# EAGLE design introAu (EAGLE 6.4)
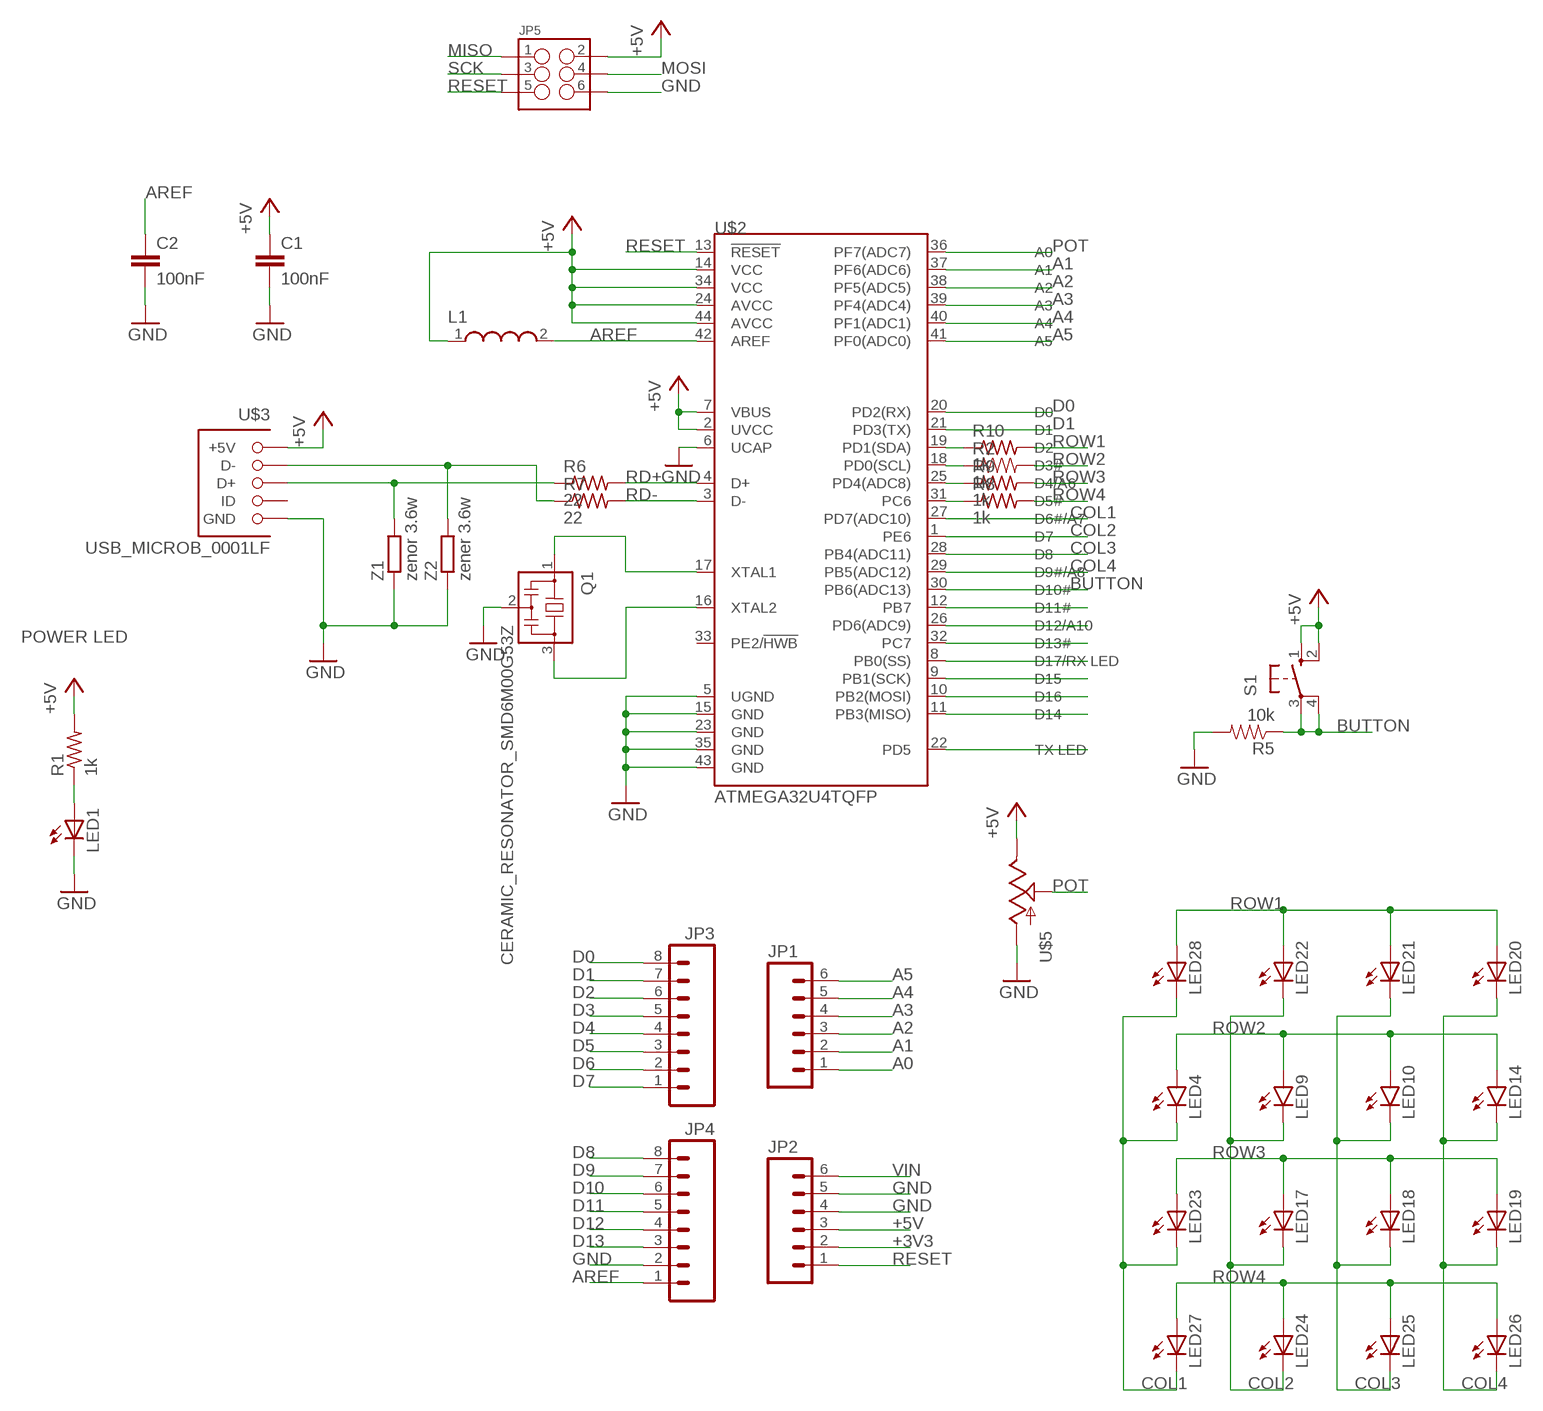
[diagram p0: schematic, sheet 1]

## Parts
C1  100nF  C-EUC0805  [C0805]
C2  100nF  C-EUC0805  [C0805]
JP1  M06SMD-STRAIGHT-COMBO  [1X06_SMD_STRAIGHT_COMBO]
JP2  M06SMD-STRAIGHT-COMBO  [1X06_SMD_STRAIGHT_COMBO]
JP3  M08SMD-COMBO  [1X08_SMD_COMBINED]
JP4  M08SMD-COMBO  [1X08_SMD_COMBINED]
JP5  M03X22X3_SILK_SM  [2X3]
L1  WE-CBF_0805(WB/HS)  [WE-CBF_0805(W=3.0)]
LED1  LEDCHIPLED_0805  [CHIPLED_0805]
LED4  LED5MM  [LED5MM]
LED9  LED5MM  [LED5MM]
LED10  LED5MM  [LED5MM]
LED14  LED5MM  [LED5MM]
LED17  LEDCHIPLED_0805  [CHIPLED_0805]
LED18  LEDCHIPLED_0805  [CHIPLED_0805]
LED19  LEDCHIPLED_0805  [CHIPLED_0805]
LED20  LEDCHIPLED_0805  [CHIPLED_0805]
LED21  LEDCHIPLED_0805  [CHIPLED_0805]
LED22  LEDCHIPLED_0805  [CHIPLED_0805]
LED23  LEDCHIPLED_0805  [CHIPLED_0805]
LED24  LEDCHIPLED_0805  [CHIPLED_0805]
LED25  LEDCHIPLED_0805  [CHIPLED_0805]
LED26  LEDCHIPLED_0805  [CHIPLED_0805]
LED27  LEDCHIPLED_0805  [CHIPLED_0805]
LED28  LEDCHIPLED_0805  [CHIPLED_0805]
Q1  CERAMIC_RESONATOR_SMD6M00G53Z  [CERAMIC_RESONATOR_SMD]
R1  1k  R-US_R0805  [R0805]
R2  1k  1KOHM1/4W5%(PTH)HORIZ-KIT  [AXIAL-0.3EZ]
R5  10k  1KOHM1/4W5%(PTH)HORIZ-KIT  [AXIAL-0.3EZ]
R6  22  R-US_R0805  [R0805]
R7  22  R-US_R0805  [R0805]
R8  1k  R-US_R0805  [R0805]
R9  1k  R-US_R0805  [R0805]
R10  1k  R-US_R0805  [R0805]
S1  TACT_BUTTON  [B3F-10XX]
U$2  ATMEGA32U4TQFP  [SPARKFUN-DIGITALIC_TQFP44]
U$3  USB_MICROB_0001LF  [USB_MICROB_CHEAPER]
U$5  POT  [ALPS_POT]
Z1  zenor 3.6w  R-EU_R0603  [R0603]
Z2  zener 3.6w  R-EU_R0603  [R0603]

## Nets
+3V3: JP2.2
+5V: C1.1 JP2.3 JP5.2 L1.1 R1.2 S1.1(S) S1.2(S1) U$2.2(UVCC) U$2.7(VBUS) U$2.14(VCC) U$2.24(AVCC) U$2.34(VCC) U$2.44(AVCC) U$3.P$1(+5V) U$5.P$1(E)
A0: JP1.1
A1: JP1.2 U$2.37(PF6(ADC6))
A2: JP1.3 U$2.38(PF5(ADC5))
A3: JP1.4 U$2.39(PF4(ADC4))
A4: JP1.5 U$2.40(PF1(ADC1))
A5: JP1.6 U$2.41(PF0(ADC0))
AREF: C2.1 JP4.1 L1.2 U$2.42(AREF)
BUTTON: R5.P$1 S1.3(P) S1.4(P1) U$2.30(PB6(ADC13))
COL1: LED4.K(C) LED23.C LED27.C LED28.C U$2.27(PD7(ADC10))
COL2: LED9.K(C) LED17.C LED22.C LED24.C U$2.1(PE6)
COL3: LED10.K(C) LED18.C LED21.C LED25.C U$2.28(PB4(ADC11))
COL4: LED14.K(C) LED19.C LED20.C LED26.C U$2.29(PB5(ADC12))
D0: JP3.8 U$2.20(PD2(RX))
D1: JP3.7 U$2.21(PD3(TX))
D2: JP3.6
D3: JP3.5
D4: JP3.4
D5: JP3.3
D6: JP3.2
D7: JP3.1
D8: JP4.8
D9: JP4.7
D10: JP4.6
D11: JP4.5 U$2.12(PB7)
D12: JP4.4 U$2.26(PD6(ADC9))
D13: JP4.3 U$2.32(PC7)
D14: U$2.11(PB3(MISO))
D15: U$2.9(PB1(SCK))
D16: U$2.10(PB2(MOSI))
D17: U$2.8(PB0(SS))
GND: C1.2 C2.2 JP2.4 JP2.5 JP4.2 JP5.6 LED1.C Q1.2 R5.P$2 U$2.5(UGND) U$2.6(UCAP) U$2.15(GND) U$2.23(GND) U$2.35(GND) U$2.43(GND) U$3.P$4(GND) U$5.P$3(A) Z1.1 Z2.1
MISO: JP5.1
MOSI: JP5.4
N$1: R10.1 U$2.19(PD1(SDA))
N$2: R2.P$1 U$2.18(PD0(SCL))
N$3: R9.1 U$2.25(PD4(ADC8))
N$4: R8.1 U$2.31(PC6)
N$5: Q1.3 U$2.16(XTAL2)
N$6: Q1.1 U$2.17(XTAL1)
N$7: R7.1 U$3.P$2(D-) Z2.2
N$9: R6.1 U$3.P$3(D+) Z1.2
N$11: LED1.A R1.1
POT: U$2.36(PF7(ADC7)) U$5.P$2(S)
RD+: R6.2 U$2.4(D+)
RD-: R7.2 U$2.3(D-)
RESET: JP2.1 JP5.5 U$2.13(!RESET)
ROW1: LED20.A LED21.A LED22.A LED28.A R10.2
ROW2: LED4.A LED9.A LED10.A LED14.A R2.P$2
ROW3: LED17.A LED18.A LED19.A LED23.A R9.2
ROW4: LED24.A LED25.A LED26.A LED27.A R8.2
SCK: JP5.3
TX: U$2.22(PD5)
VIN: JP2.6
Unconnected: U$2.33(PE2/!HWB) U$3.P$5(ID)

## Notes on the sheet
- POWER LED

## Library data of the parts
C1 C2 = rcl:C-EU: CAPACITOR, European symbol
JP1 JP2 = SparkFun-Connectors:M06: Header 6 Standard 6-pin 0.1" header. Use with straight break away headers (SKU : PRT-00116), right angle break away headers (PRT-00553), swiss pins (PRT-00743), machine pins (PRT-00117), and female headers (PRT-00115). Molex polarized connector foot print use with SKU : PRT-08094 with associated crimp pins and housings. NOTES ON THE VARIANTS LOCK and LOCK_LONGPADS... This footprint was designed to help hold the alignment of a through-hole component (i.e. 6-pin header) while soldering it into place. You may notice that each hole has been shifted either up or down by 0.005 of an inch from it's more standard position (which is a perfectly straight line). This slight alteration caused the pins (the squares in the middle) to touch the edges of the holes. Because they are alternating, it causes a "brace" to hold the component in place. 0.005 has proven to be the perfect amount of "off-center" position when using our standard breakaway headers. Although looks a little odd when you look at the bare footprint, once you have a header in there, the alteration is very hard to notice. Also,if you push a header all the way into place, it is covered up entirely on the bottom side. This idea of altering the position of holes to aid alignment will be further integrated into the Sparkfun Library for other footprints. It can help hold any component with 3 or more connection pins.
JP3 JP4 = SparkFun-Connectors:M08: Header 8 Standard 8-pin 0.1" header. Use with straight break away headers (SKU : PRT-00116), right angle break away headers (PRT-00553), swiss pins (PRT-00743), machine pins (PRT-00117), and female headers (PRT-00115).
JP5 = SparkFun-Connectors:M03X2: 2x3 .1" header. Shrouded, with keying- CONN-10681 SMT- CONN-11415 Pogo pins- HW-11044
L1 = EagleLibrary_Wuerth_Elektronik_eiSos_rev15c:WE-CBF: WE-CBF SMD EMI Suppression Ferrite Bead Characteristics Reliable Ni-Sn electrodes High rated current up to 6 A Operating temperature: –55 ºC to +125 ºC Applications Perfect as data lined filter and for uncoupling of distribution voltage Variant abbreviation WB means WIDE BAND HS means HIGH SPEED HC means HIGH CURRENT <http://katalog.we-online.de/media/images/eisos/FeCBF_pf2.jpg> Details see: http://katalog.we-online.de/en/pbs/WE-CBF Updated on 2014-06-19 2014 (C) Wurth Elektronik
LED1 LED17-LED28 = led:LED: LED OSRAM: - CHIPLED LG R971, LG N971, LY N971, LG Q971, LY Q971, LO R971, LY R971 LH N974, LH R974 LS Q976, LO Q976, LY Q976 LO Q996 - Hyper CHIPLED LW Q18S LB Q993, LB Q99A, LB R99A - SideLED LS A670, LO A670, LY A670, LG A670, LP A670 LB A673, LV A673, LT A673, LW A673 LH A674 LY A675 LS A676, LA A676, LO A676, LY A676, LW A676 LS A679, LY A679, LG A679 - Hyper Micro SIDELED® LS Y876, LA Y876, LO Y876, LY Y876 LT Y87S - SmartLED LW L88C, LW L88S LB L89C, LB L89S, LG L890 LS L89K, LO L89K, LY L89K LS L896, LA L896, LO L896, LY L896 - TOPLED LS T670, LO T670, LY T670, LG T670, LP T670 LSG T670, LSP T670, LSY T670, LOP T670, LYG T670 LG T671, LOG T671, LSG T671 LB T673, LV T673, LT T673, LW T673 LH T674 LS T676, LA T676, LO T676, LY T676, LB T676, LH T676, LSB T676, LW T676 LB T67C, LV T67C, LT T67C, LS T67K, LO T67K, LY T67K, LW E67C LS E67B, LA E67B, LO E67B, LY E67B, LB E67C, LV E67C, LT E67C LW T67C LS T679, LY T679, LG T679 LS T770, LO T770, LY T770, LG T770, LP T770 LB T773, LV T773, LT T773, LW T773 LH T774 LS E675, LA E675, LY E675, LS T675 LS T776, LA T776, LO T776, LY T776, LB T776 LHGB T686 LT T68C, LB T68C - Hyper Mini TOPLED® LB M676 - Mini TOPLED Santana® LG M470 LS M47K, LO M47K, LY M47K Source: http://www.osram.convergy.de LUXEON: - LUMILED® LXK2-PW12-R00, LXK2-PW12-S00, LXK2-PW14-U00, LXK2-PW14-V00 LXK2-PM12-R00, LXK2-PM12-S00, LXK2-PM14-U00 LXK2-PE12-Q00, LXK2-PE12-R00, LXK2-PE12-S00, LXK2-PE14-T00, LXK2-PE14-U00 LXK2-PB12-K00, LXK2-PB12-L00, LXK2-PB12-M00, LXK2-PB14-N00, LXK2-PB14-P00, LXK2-PB14-Q00 LXK2-PR12-L00, LXK2-PR12-M00, LXK2-PR14-Q00, LXK2-PR14-R00 LXK2-PD12-Q00, LXK2-PD12-R00, LXK2-PD12-S00 LXK2-PH12-R00, LXK2-PH12-S00 LXK2-PL12-P00, LXK2-PL12-Q00, LXK2-PL12-R00 Source: www.luxeon.com KINGBRIGHT: KA-3528ASYC Source: www.kingbright.com
LED4 LED9 LED10 LED14 = SparkFun-LED:LED: LEDs Standard schematic elements and footprints for 5mm, 3mm, 1206, and 0603 sized LEDs. 5mm - Spark Fun Electronics SKU : COM-00529 (and others)
Q1 = MESH_Arduino:CERAMIC_RESONATOR_SMD: Resonator Source: murata.co.jp; MPN: CSTCR6M00G53-R0; OC_FARNELL: 1170434; OC_NEWARK: 25M8759
R1 R6-R10 = rcl:R-US_: RESISTOR, American symbol
R2 = SparkFun-Resistors:1KOHM1/4W5%(PTH): RES-08380; PROD_ID: RES-08380
R5 = SparkFun-Resistors:1KOHM1/4W5%(PTH): RES-08380; PROD_ID: RES-08380; VALUE: 1k
S1 = MESH_Arduino:TACT_BUTTON: OMRON SWITCH; MPN: B3F-1000; OC_FARNELL: 176432; OC_NEWARK: 36M3542
U$2 = SparkFun-DigitalIC:ATMEGA32U4: Atmel 44-pin 8-bit Microcontroller with 32KBytes of ISP Flash and USB Controller ----- Please use the QFN-44-NOPAD_1:1 package for the footprint of all boards using a 32U4. Route traces directly away from the pads as much as possible.
U$3 = mBLE:USB_MICROB_0001LF
U$5 = SparkFun-Electromechanical:POT
Z1 Z2 = rcl:R-EU_: RESISTOR, European symbol

## Board
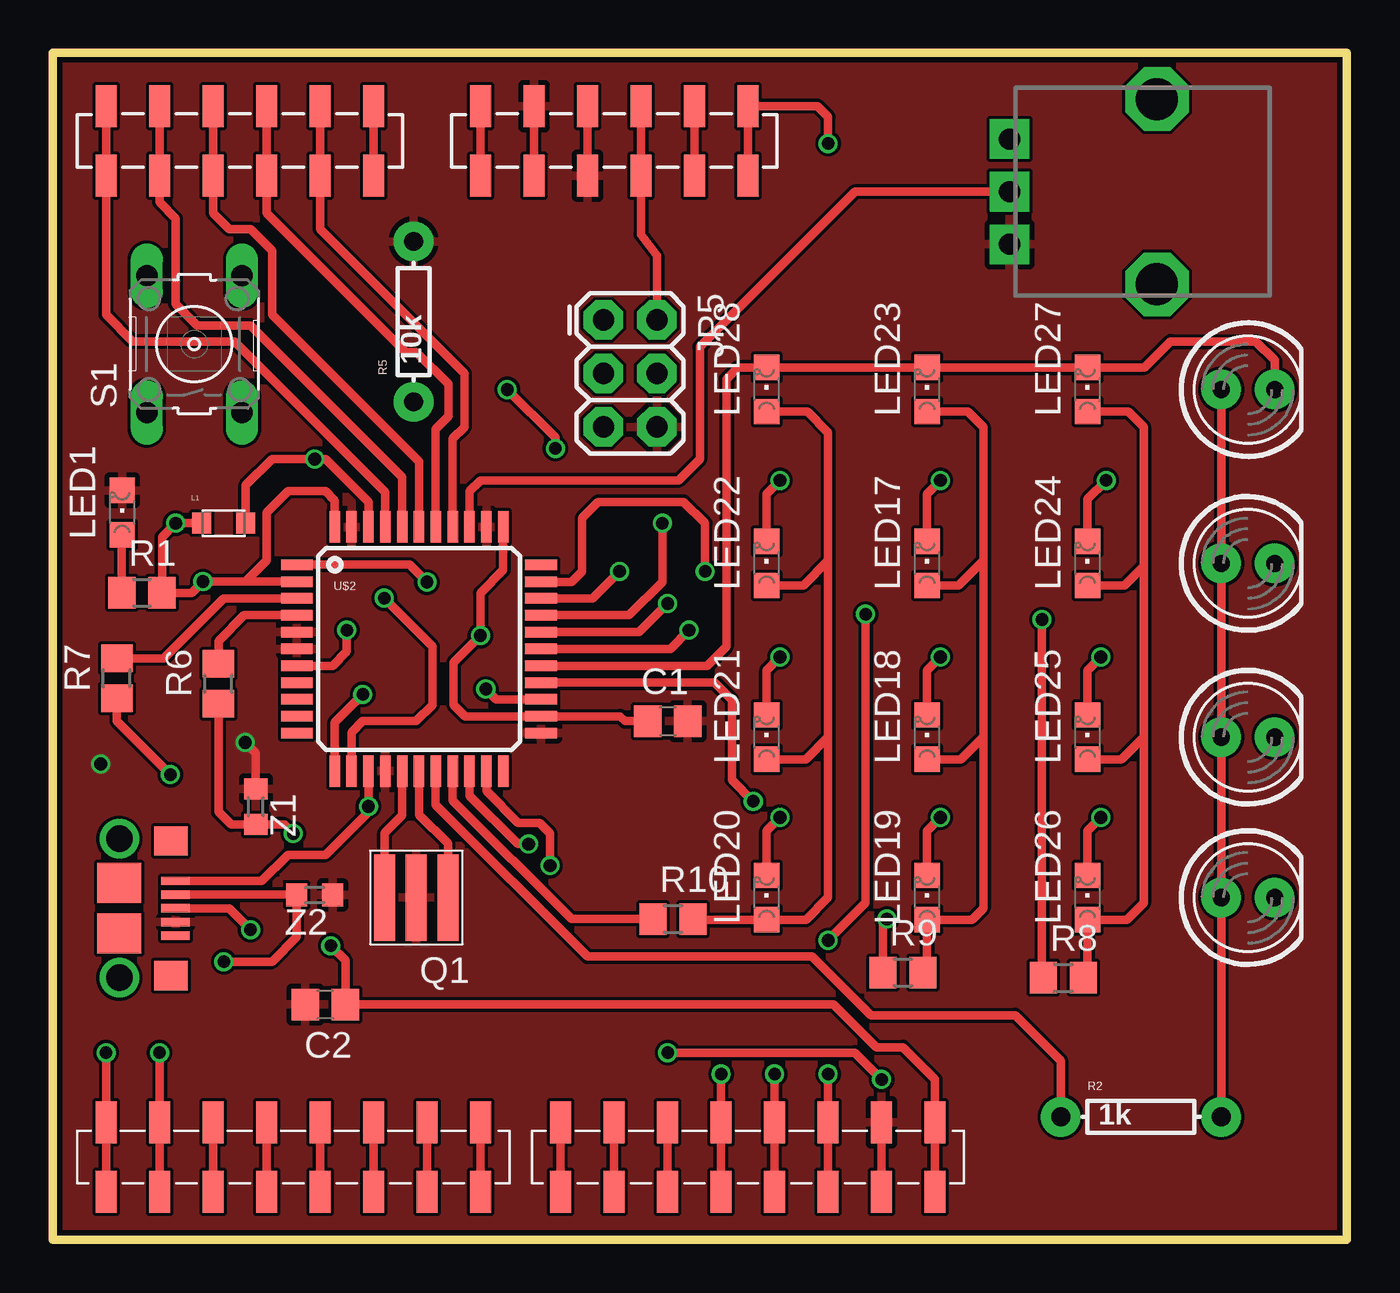
[diagram p1: board, top side]
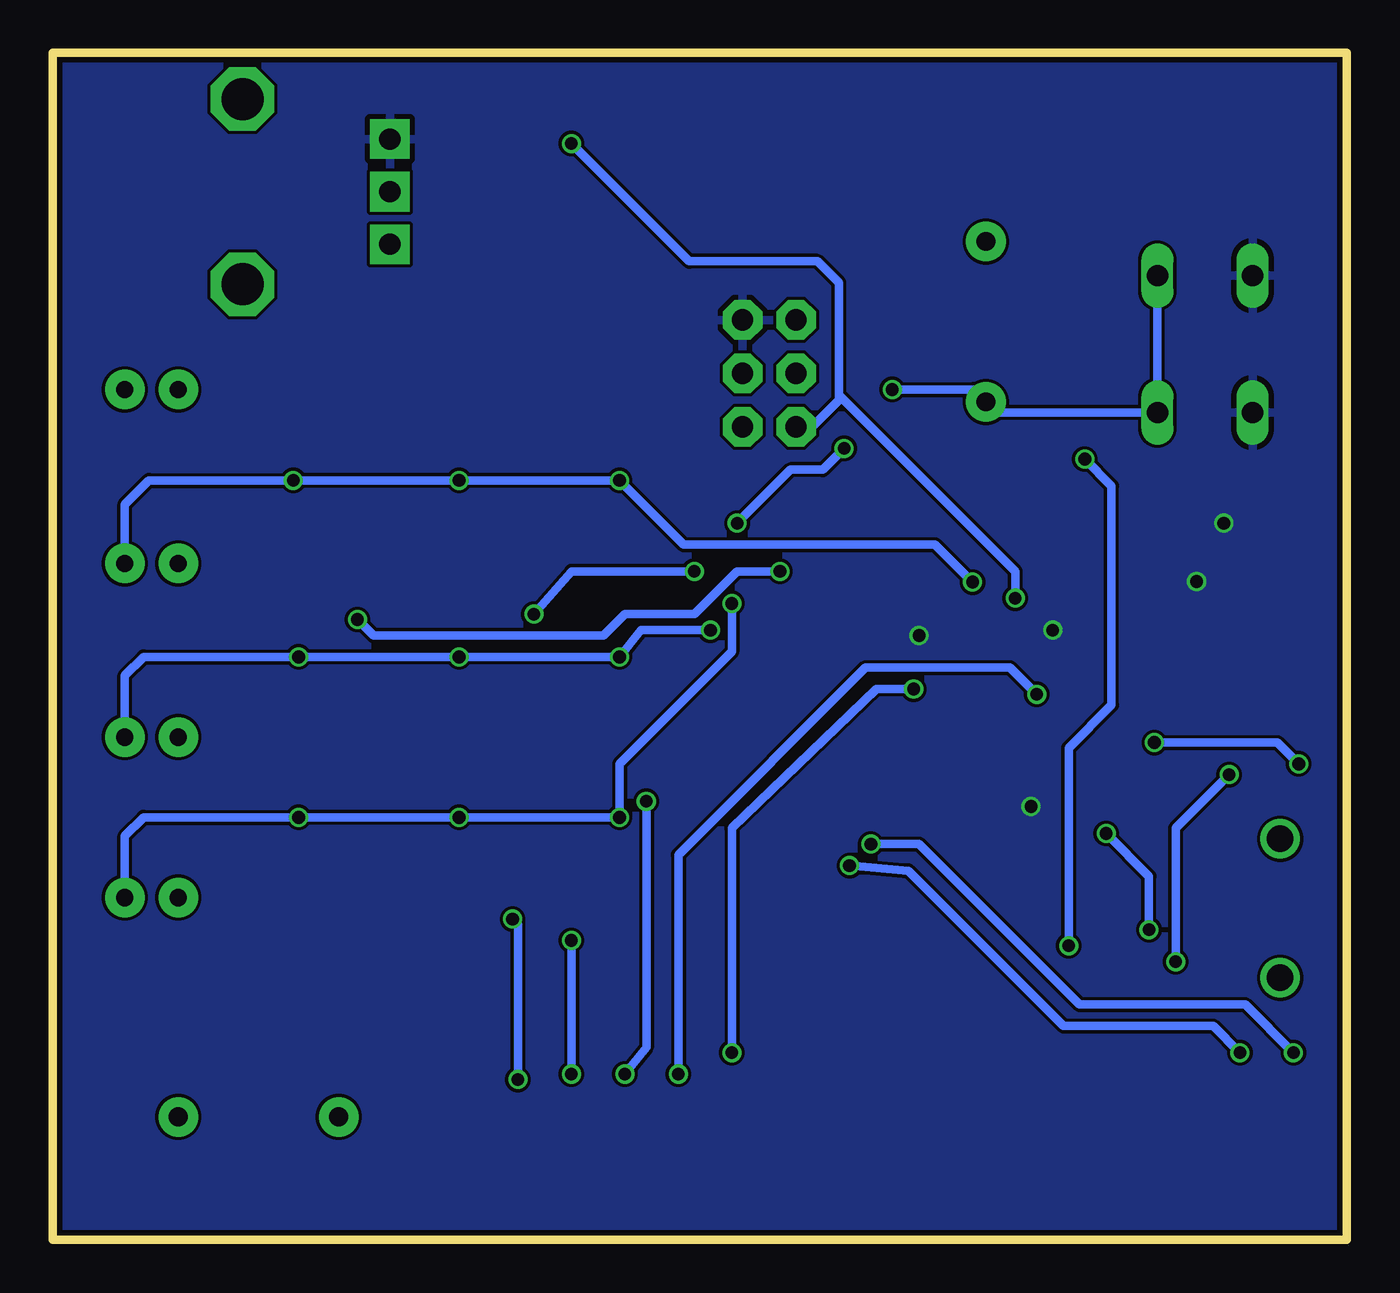
[diagram p2: board, bottom side, seen from below]

Size 61.47 x 56.39 mm. Coordinates in mm from the lower left corner, seen from the top.
Outline: 0,56.39 61.47,56.39 61.47,0 0,0 0,56.39
Copper layers (1*16): Top 0.035mm / dielectric 1.5mm / Bottom 0.035mm
Design rules "SeeedStudio_2layer_DRU_no_angle_20140221": minimum track width 6mil, minimum drill 12mil, track to track 6mil, track to pad 6mil, pad to pad 6mil, via to via 6mil, smd to smd 0mil, copper to edge 10mil, drill to drill 10mil, minimum pad ring 10mil, minimum via ring 6mil, stop-mask expansion 2mil, vias tented up to drill 100mil, thermal gap 10mil

### Footprints (pad centres in the part's own frame; a part is rotated, then mirrored left to right if it is on the bottom)
C0805 = smd 1.3 x 1.5: 1 -0.95,0; 2 0.95,0
1X06_SMD_STRAIGHT_COMBO = smd 1 x 2: 1 0,-1.65; 1-2 0,1.65; 2 2.54,1.65; 2-2 2.54,-1.65; 3 5.08,-1.65; 3-2 5.08,1.65; 4 7.62,1.65; 4-2 7.62,-1.65; 5 10.16,-1.65; 5-2 10.16,1.65; 6 12.7,1.65; 6-2 12.7,-1.65
1X08_SMD_COMBINED = smd 1 x 2: 1 0,1.65; 1@2 0,-1.65; 2 2.54,-1.65; 2@2 2.54,1.65; 3 5.08,1.65; 3@2 5.08,-1.65; 4 7.62,-1.65; 4@2 7.62,1.65; 5 10.16,1.65; 5@2 10.16,-1.65; 6 12.7,-1.65; 6@2 12.7,1.65; 7 15.24,1.65; 7@2 15.24,-1.65; 8 17.78,-1.65; 8@2 17.78,1.65
2X3 = drill 1.016 pad 1.88 octagon: 1 0,0; 2 0,2.54; 3 2.54,0; 4 2.54,2.54; 5 5.08,0; 6 5.08,2.54
WE-CBF_0805(W=3.0) = smd 0.9 x 1: 1 -1.05,0; 2 1.05,0
CHIPLED_0805 = smd 1.2 x 1.2: A 0,-1.05; C 0,1.05
LED5MM = drill 0.813 pad 1.88: A -1.27,0; K 1.27,0
CERAMIC_RESONATOR_SMD = smd 1 x 4.1: 1 -1.5,0; 2 0,0; 3 1.5,0
R0805 = smd 1.3 x 1.5: 1 -0.95,0; 2 0.95,0
AXIAL-0.3EZ = drill 0.9 pad 1.88: P$1 -3.81,0; P$2 3.81,0
B3F-10XX = drill 1.016 long: 1 -3.251,2.261; 2 3.251,2.261; 3 -3.251,-2.261; 4 3.251,-2.261
SPARKFUN-DIGITALIC_TQFP44 = smd 1.5 x 0.5: 1 -5.8,4; 2 -5.8,3.2; 3 -5.8,2.4; 4 -5.8,1.6; 5 -5.8,0.8; 6 -5.8,0; 7 -5.8,-0.8; 8 -5.8,-1.6; 9 -5.8,-2.4; 10 -5.8,-3.2; 11 -5.8,-4; 23 5.8,-4; 24 5.8,-3.2; 25 5.8,-2.4; 26 5.8,-1.6; 27 5.8,-0.8; 28 5.8,0; 29 5.8,0.8; 30 5.8,1.6; 31 5.8,2.4; 32 5.8,3.2; 33 5.8,4 | smd 0.5 x 1.5: 12 -4,-5.8; 13 -3.2,-5.8; 14 -2.4,-5.8; 15 -1.6,-5.8; 16 -0.8,-5.8; 17 0,-5.8; 18 0.8,-5.8; 19 1.6,-5.8; 20 2.4,-5.8; 21 3.2,-5.8; 22 4,-5.8; 34 4,5.8; 35 3.2,5.8; 36 2.4,5.8; 37 1.6,5.8; 38 0.8,5.8; 39 0,5.8; 40 -0.8,5.8; 41 -1.6,5.8; 42 -2.4,5.8; 43 -3.2,5.8; 44 -4,5.8
USB_MICROB_CHEAPER = smd 0.4 x 1.35: P$1 -1.3,0; P$2 -0.65,0; P$3 0,0; P$4 0.65,0; P$5 1.3,0 | smd 1.4 x 1.6: P$6 -3.2,-0.225; P$7 3.2,-0.225 | drill 1.25: P$8 -3.3,-2.675; P$9 3.3,-2.675 | smd 1.9 x 2.1: P$10 -1.2,-2.675; P$12 1.2,-2.675
ALPS_POT = drill 1 pad 1.88 square: P$1 7,-2.5; P$2 7,0; P$3 7,2.5 | drill 2 octagon: P$4 0,-4.4; P$5 0,4.4
R0603 = smd 1 x 1.1: 1 -0.85,0; 2 0.85,0

### Placement (x,y rotation side)
C1  29.21,24.64 0 top
C2  12.95,11.18 180 top
JP1  15.24,52.2 180 top
JP2  33.02,52.2 180 top
JP3  20.32,3.94 180 top
JP4  41.91,3.94 180 top
JP5  26.16,43.69 270 top
L1  8.13,34.04 0 top
LED1  3.3,34.54 0 top
LED4  56.77,40.39 0 top
LED9  56.77,32.13 0 top
LED10  56.77,23.88 0 top
LED14  56.77,16.26 0 top
LED17  41.53,32.13 0 top
LED18  41.53,23.88 0 top
LED19  41.53,16.26 0 top
LED20  33.91,16.26 0 top
LED21  33.91,23.88 0 top
LED22  33.91,32.13 0 top
LED23  41.53,40.39 0 top
LED24  49.15,32.13 0 top
LED25  49.15,23.88 0 top
LED26  49.15,16.26 0 top
LED27  49.15,40.39 0 top
LED28  33.91,40.39 0 top
Q1  17.27,16.26 180 top
R1  4.24,30.73 0 top
R2  51.69,5.84 0 top
R5  17.14,43.61 90 top
R6  7.87,26.42 90 top
R7  3.05,26.67 90 top
R8  48.01,12.45 0 top
R9  40.39,12.7 0 top
R10  29.46,15.24 0 top
S1  6.73,42.55 90 top
U$2  17.4,28.07 0 top
U$3  5.84,15.75 270 top
U$5  52.45,49.78 180 top
Z1  9.65,20.57 270 top
Z2  12.45,16.38 180 top

### Tracks (layer width: path | path; a pad name or v marks a point on that pad's centre or on a via)
+5V  (via drill 0.6)
  Top 0.406: L1.1 v5.84,34.04 5.19,33.39 R1.2 6.6,30.73 v7.14,31.27 9.17,31.27 | U$2.2 9.17,31.27 | U$2.7 13.3,27.27 13.97,27.94 v13.97,28.96 | U$3.P$1 9.94,17.05 11.18,18.29 12.95,18.29 15,20.33 v15,20.59 U$2.14 | U$2.34 21.4,31.81 20.32,30.73 v20.32,28.7 19.05,27.43 19.05,25.4 19.58,24.87 U$2.24 26.95,24.87 27.18,24.64 C1.1 | U$2.44 13.4,35.11 12.95,35.56 11.18,35.56 10.16,34.54 10.16,32.26 9.17,31.27 | JP2.3 27.94,47.75 28.7,46.74 JP5.2
  pour Bottom: -0.76,-1.02 -0.76,57.66 62.74,57.66 62.74,-1.27
A1
  Top 0.406: U$2.37 19,38.05 19.56,38.61 19.56,41.15 12.7,48.01 JP1.2
A2
  Top 0.406: U$2.38 18.2,38.52 18.8,39.12 18.8,40.64 17.27,42.16 16.76,42.16 10.16,48.77 JP1.3
A3
  Top 0.406: U$2.39 17.4,36.96 10.41,43.94 10.41,46.99 9.4,48.01 8.38,48.01 7.62,48.77 JP1.4
A4
  Top 0.406: JP1.5 5.08,49.28 5.84,48.51 5.84,44.45 6.86,43.43 9.4,43.43 16.6,36.23 U$2.40
A5
  Top 0.406: U$2.41 15.8,35.51 8.64,42.67 3.81,42.67 2.54,43.94 JP1.6
AREF  (via drill 0.6)
  Top 0.406: L1.2 9.18,35.85 10.41,37.08 v12.45,37.08 12.95,37.08 15,35.04 U$2.42 | v13.21,13.97 13.9,13.27 C2.1 37.08,11.18 39.12,9.14 40.39,9.14 41.91,7.62 JP4.1
  Bottom 0.406: v13.21,13.97 13.21,23.37 11.18,25.4 11.18,35.81 v12.45,37.08
BUTTON  (via drill 0.6)
  Top 0.406: U$2.30 27.38,29.67 28.96,31.24 v28.96,34.04 | v23.88,37.59 23.88,38.1 v21.59,40.39
  Bottom 0.406: S1.4 S1.3 16.64,39.29 R5.P$1 17.73,40.39 v21.59,40.39 | v23.88,37.59 24.89,36.58 26.42,36.58 v28.96,34.04
COL1
  Top 0.406: LED4.K 58.04,41.78 57.15,42.67 53.09,42.67 51.85,41.44 LED27.C LED23.C LED28.C 32.55,41.44 32,40.89 32,28.19 31.08,27.27 U$2.27
COL2  (via drill 0.6)
  Top 0.406: v50.04,36.07 49.15,35.18 LED24.C | LED17.C 41.53,35.43 v42.16,36.07 | LED22.C 33.91,35.43 v34.54,36.07 | U$2.1 16.95,32.07 v17.78,31.24
  Bottom 0.406: LED9.K 58.04,34.92 56.9,36.07 v50.04,36.07 v42.16,36.07 v34.54,36.07 31.5,33.02 19.56,33.02 v17.78,31.24
COL3  (via drill 0.6)
  Top 0.406: v49.78,27.69 49.15,27.05 LED25.C | LED18.C 41.53,27.05 v42.16,27.69 | LED21.C 33.91,27.05 v34.54,27.69 | U$2.28 29.34,28.07 v30.23,28.96
  Bottom 0.406: LED10.K 58.04,26.8 57.15,27.69 v49.78,27.69 v42.16,27.69 v34.54,27.69 33.53,28.96 v30.23,28.96
COL4  (via drill 0.6)
  Top 0.406: v49.78,20.07 49.15,19.43 LED26.C | LED19.C 41.53,19.43 v42.16,20.07 | LED20.C 33.91,19.43 v34.54,20.07 | U$2.29 27.85,28.87 v29.21,30.23
  Bottom 0.406: LED14.K 58.04,19.18 57.15,20.07 v49.78,20.07 v42.16,20.07 v34.54,20.07 34.54,22.61 29.21,27.94 v29.21,30.23
D0  (via drill 0.6)
  Top 0.406: U$2.20 19.8,21.09 22.1,18.8 v22.61,18.8 | v2.54,8.89 JP3.8
  Bottom 0.406: v22.61,18.8 20.32,18.8 12.7,11.18 4.83,11.18 v2.54,8.89
D1  (via drill 0.6)
  Top 0.406: U$2.21 20.6,21.31 22.1,19.81 23.11,19.81 23.62,19.3 v23.62,17.78 | v5.08,8.89 JP3.7
  Bottom 0.406: v23.62,17.78 20.83,17.53 13.46,10.16 6.35,10.16 v5.08,8.89
D11  (via drill 0.6)
  Top 0.406: U$2.12 13.4,24.57 v14.73,25.91 | JP4.5 v31.75,7.87
  Bottom 0.406: v14.73,25.91 16,27.18 22.86,27.18 31.75,18.29 v31.75,7.87
D12  (via drill 0.6)
  Top 0.406: U$2.26 31.45,26.47 32.26,25.65 32.26,21.84 v33.27,20.83 | v34.29,7.87 JP4.4
  Bottom 0.406: v33.27,20.83 33.27,9.14 v34.29,7.87
D13  (via drill 0.6)
  Top 0.406: v38.61,29.72 38.61,16 v36.83,14.22 | v36.83,7.87 JP4.3 | U$2.32 23.22,31.24 24.64,31.24 25.15,31.75 25.15,34.29 25.91,35.05 29.97,35.05 30.99,34.04 v30.99,31.75
  Bottom 0.406: v30.99,31.75 36.83,31.75 v38.61,29.72 | v36.83,14.22 v36.83,7.87
GND  (via drill 0.6)
  Top 0.406: Z1.1 9.65,23.11 v9.14,23.62
  Bottom 0.406: v9.14,23.62 3.3,23.62 v2.29,22.61
  pour Top: -0.76,-1.02 -0.76,57.4 62.74,57.4 62.74,-1.02
N$1
  Top 0.406: R10.1 24.64,15.24 19,20.88 U$2.19
N$2
  Top 0.406: U$2.18 18.2,20.66 25.4,13.46 36.07,13.46 38.86,10.67 45.72,10.67 47.88,8.51 R2.P$1
N$3  (via drill 0.6)
  Top 0.406: U$2.25 21.07,25.67 v20.57,26.16 | v29.21,8.89 38.1,8.89 v39.37,7.62 | v39.62,15.24 39.44,15.05 R9.1
  Bottom 0.406: v20.57,26.16 22.35,26.16 29.21,19.56 v29.21,8.89 | v39.37,7.62 39.37,14.99 v39.62,15.24
N$4  (via drill 0.6)
  Top 0.406: U$2.31 25.64,30.47 v26.92,31.75 | v46.99,29.46 46.99,12.51 R8.1
  Bottom 0.406: v26.92,31.75 28.96,31.75 30.99,29.72 34.29,29.72 35.31,28.7 46.23,28.7 v46.99,29.46
N$5
  Top 0.406: Q1.3 15.77,19.33 16.6,20.16 U$2.16
N$6
  Top 0.406: Q1.1 18.77,18.82 17.4,20.19 U$2.17
N$7  (via drill 0.6)
  Top 0.406: U$3.P$2 11.58,16.4 Z2.2 11.6,14.39 10.41,13.21 v8.13,13.21 | R7.1 3.05,24.64 v5.59,22.1
  Bottom 0.406: v8.13,13.21 8.13,19.56 v5.59,22.1
N$9  (via drill 0.6)
  Top 0.406: R6.1 7.87,20.32 8.47,19.72 Z1.2 11.01,19.72 v11.43,19.3 | U$3.P$3 8.38,15.75 v9.4,14.73
  Bottom 0.406: v9.4,14.73 9.4,17.27 v11.43,19.3
N$11
  Top 0.406: R1.1 LED1.A
POT
  Top 0.406: U$5.P$2 38.1,49.78 30.73,42.42 30.73,37.08 29.72,36.07 20.32,36.07 19.81,35.56 19.81,33.88 U$2.36
RD+
  Top 0.406: U$2.4 9.09,29.67 7.87,28.45 R6.2
RD-
  Top 0.406: U$2.3 8.12,30.47 5.27,27.62 R7.2
RESET  (via drill 0.6)
  Top 0.406: v36.83,52.07 36.83,53.34 36.32,53.85 JP2.1 | U$2.13 14.2,24.11 14.73,24.64 17.27,24.64 18.03,25.4 18.03,28.19 v15.75,30.48
  Bottom 0.406: JP5.5 25.4,38.61 24.13,39.88 24.13,40.13 | 24.13,40.13 24.13,45.47 25.15,46.48 31.24,46.48 v36.83,52.07 | v15.75,30.48 15.75,31.75 24.13,40.13
ROW1
  Top 0.406: LED28.A 35.85,39.34 36.83,38.35 36.83,32.26 | 36.83,32.26 36.83,23.88 | 36.83,23.88 36.83,16.26 35.78,15.21 LED20.A 30.45,15.21 R10.2 | LED21.A 35.78,22.83 36.83,23.88 | LED22.A 35.65,31.08 36.83,32.26
ROW2
  Top 0.406: R2.P$2 LED14.A LED10.A LED9.A LED4.A
ROW3
  Top 0.406: LED23.A 43.47,39.34 44.2,38.61 44.2,32.26 | 44.2,32.26 44.2,23.88 | 44.2,23.88 44.2,15.75 43.65,15.21 LED19.A 41.53,12.89 R9.2 | LED18.A 43.15,22.83 44.2,23.88 | LED17.A 43.02,31.08 44.2,32.26
ROW4
  Top 0.406: LED27.A 51.09,39.34 51.82,38.61 51.82,32 | 51.82,32 51.82,23.88 | 51.82,23.88 51.82,16 51.02,15.21 LED26.A 49.15,12.64 R8.2 | LED25.A 50.77,22.83 51.82,23.88 | LED24.A 50.89,31.08 51.82,32